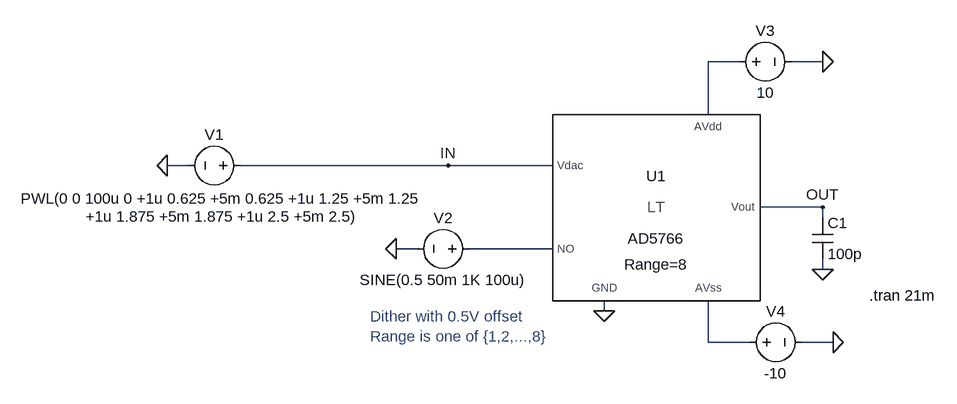
[diagram p0: schematic AD5766.asc]
AD5766.asc, the LTspice schematic file:
Version 4
SHEET 1 2580 1520
WIRE 224 400 176 400
WIRE 352 400 304 400
WIRE 176 480 176 400
WIRE -624 560 -656 560
WIRE -224 560 -544 560
WIRE -64 560 -224 560
WIRE 352 624 256 624
WIRE 352 640 352 624
WIRE -272 688 -304 688
WIRE -64 688 -192 688
WIRE 352 720 352 704
WIRE 16 784 16 768
WIRE 176 832 176 768
WIRE 240 832 176 832
WIRE 368 832 320 832
FLAG -656 560 0
FLAG 352 720 0
FLAG 352 624 OUT
FLAG 352 400 0
FLAG -304 688 0
FLAG 16 784 0
FLAG 368 832 0
FLAG -224 560 IN
SYMBOL cap 336 640 R0
SYMATTR InstName C1
SYMATTR Value 100p
SYMBOL voltage -176 688 M270
WINDOW 0 32 56 VTop 2
WINDOW 3 -32 56 VBottom 2
WINDOW 123 -74 56 VBottom 2
WINDOW 39 -53 56 VBottom 2
SYMATTR InstName V2
SYMATTR Value SINE(0.5 50m 1K 100u)
SYMBOL voltage -528 560 R90
WINDOW 0 -32 56 VBottom 2
WINDOW 3 35 42 VTop 2
WINDOW 123 63 42 VTop 2
SYMATTR InstName V1
SYMATTR Value PWL(0 0 100u 0 +1u 0.625 +5m 0.625 +1u 1.25 +5m 1.25
SYMATTR Value2 +1u 1.875 +5m 1.875 +1u 2.5 +5m 2.5)
SYMBOL voltage 208 400 R270
WINDOW 0 32 56 VTop 2
WINDOW 3 -32 56 VBottom 2
SYMATTR InstName V3
SYMATTR Value 10
SYMBOL voltage 224 832 R270
WINDOW 0 32 56 VTop 2
WINDOW 3 -32 56 VBottom 2
SYMATTR InstName V4
SYMATTR Value -10
SYMBOL DAC\\AD5766 96 624 R0
SYMATTR InstName U1
TEXT 424 760 Left 2 !.tran 21m
TEXT -344 792 Left 2 ;Dither with 0.5V offset\nRange is one of {1,2,...,8}

The netlist it stands for:
* AD5766.asc
C1 OUT 0 100p
V2 N002 0 SINE(0.5 50m 1K 100u)
V1 IN 0 PWL(0 0 100u 0 +1u 0.625 +5m 0.625 +1u 1.25 +5m 1.25 +1u 1.875 +5m 1.875 +1u 2.5 +5m 2.5)
V3 N001 0 10
V4 N003 0 -10
XU1 IN N002 N001 N003 OUT 0 AD5766 AD5766 Range=8  ; pins Vdac NO AVdd AVss Vout GND
.tran 21m
* Dither with 0.5V offset
* Range is one of {1,2,...,8}
.lib AD5766.sub
.backanno
.end